# Altium project DoorControlSystem.PrjPcb
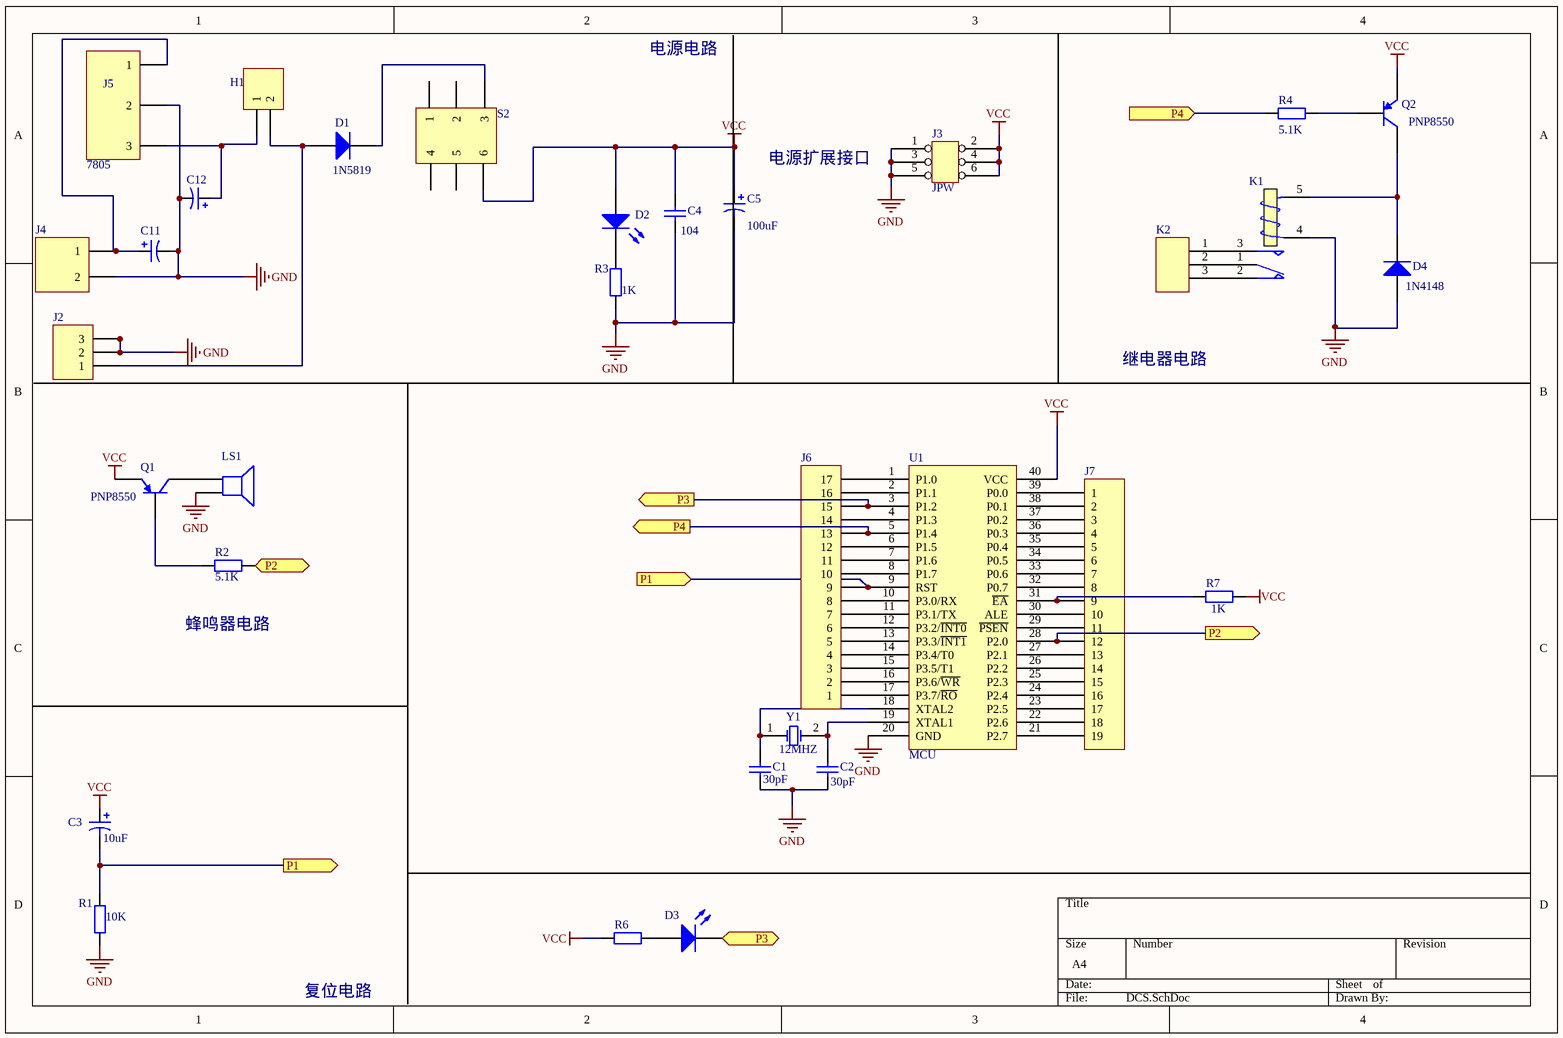
[diagram p0: DCS.SchDoc]
1 sheet, 32 parts. Net scope: flat (ports and power ports of the same name join across sheets).
Board file: PCB1.PcbDoc

## Sheet DCS.SchDoc
size A4

### Parts
C1  value 30pF  [CAP_104]  (hidden comment: Cap)
C2  value 30pF  [CAP_104]  (hidden comment: Cap)
C3  value 10uF  [CAP_10UF]  (hidden comment: Cap2)
C4  Cap  [CAP_104]  (value not drawn)
C5  value 100uF  [Cap_100uF]  (hidden comment: Cap2)
C11  Cap_100uF  [CAP_1000UF]  (value not drawn)
C12  Cap_100uF  [Cap_100uF]  (value not drawn)
D1  Diode 1N5408  [IN5819]  (value not drawn)
D2  LED0  [LED]  (value not drawn)
D3  LED0  [LED]  (value not drawn)
D4  Diode 1N4148  [DO-35]  (value not drawn)
H1  Header 2H  [Head2]  (value not drawn)
J2  Header 3  [POWER_DC5V]  (value not drawn)
J3  JPW  [JPW]
J4  Power_DC12V  [Power_DC12V]  (value not drawn)
J5  7805  [7805]
J6  Header 17  [HDR1X17]  (value not drawn)
J7  Header 19  [HDR1X19]  (value not drawn)
K1  Relay  [Relay]  (value not drawn)
K2  CRelay  [CRelay]  (value not drawn)
LS1  Speaker  [Speaker]  (value not drawn)
Q1  2N3906  [8550]  (value not drawn)
Q2  2N3906  [8550]  (value not drawn)
R1  value 10K  [AXIAL-0.4]  (hidden comment: Res2)
R2  value 5.1K  [AXIAL-0.4]  (hidden comment: Res2)
R3  value 1K  [AXIAL-0.4]  (hidden comment: Res2)
R4  value 5.1K  [AXIAL-0.4]  (hidden comment: Res2)
R6  Res2  [AXIAL-0.4]  (value not drawn)
R7  value 1K  [AXIAL-0.4]  (hidden comment: Res2)
S2  SW6  [SW6]  (value not drawn)
U1  MCU  [MCU]
Y1  XTAL  [crystals]  (value not drawn)

### Ports
P1 (in), P1 (out), P2 (in), P2 (out), P3, P3 (out), P4 (in), P4 (out)

### Nets
GND: C1.1 C2.1 C4.1 C5.2 C11.2 C12.2 D4.1(A) J2.2 J2.3 J3.1 J3.3 J3.5 J4.2 J5.2 K1.4(T) LS1.2 R1.1 R3.1 U1.20(GND)
VCC: C3.1 C4.2 C5.1 D2.1(A) J3.2 J3.4 J3.6 Q1.1(E) Q2.1(E) R6.1 R7.2 S2.6 U1.40(VCC)
NetC1_2: C1.2 U1.18(XTAL2) Y1.1(OSC1)
NetC2_2: C2.2 U1.19(XTAL1) Y1.2(OSC2)
NetC3_2: C3.2 J6.9 R1.2 U1.9(RST) ; port P1
NetC11_1: C11.1 J4.1 J5.1
NetC12_1: C12.1 H1.1 J5.3
NetD1_1: D1.1(A) H1.2 J2.1
NetD1_2: D1.2(K) S2.3
NetD2_2: D2.2(K) R3.2
NetD3_1: D3.1(A) R6.2
NetD3_2: D3.2(K) J6.15 U1.3(P1.2) ; port P3
NetD4_2: D4.2(K) K1.5(VSS) Q2.3(C)
NetJ6_1: J6.1 U1.17(P3.7/~{RO})
NetJ6_2: J6.2 U1.16(P3.6/~{WR})
NetJ6_3: J6.3 U1.15(P3.5/T1)
NetJ6_4: J6.4 U1.14(P3.4/T0)
NetJ6_5: J6.5 U1.13(P3.3/~{INT1})
NetJ6_6: J6.6 U1.12(P3.2/~{INT0})
NetJ6_7: J6.7 U1.11(P3.1/TX)
NetJ6_8: J6.8 U1.10(P3.0/RX)
NetJ6_10: J6.10 U1.8(P1.7)
NetJ6_11: J6.11 U1.7(P1.6)
NetJ6_12: J6.12 U1.6(P1.5)
NetJ6_13: J6.13 R4.2 U1.5(P1.4) ; port P4
NetJ6_14: J6.14 U1.4(P1.3)
NetJ6_16: J6.16 U1.2(P1.1)
NetJ6_17: J6.17 U1.1(P1.0)
NetJ7_1: J7.1 U1.39(P0.0)
NetJ7_2: J7.2 U1.38(P0.1)
NetJ7_3: J7.3 U1.37(P0.2)
NetJ7_4: J7.4 U1.36(P0.3)
NetJ7_5: J7.5 U1.35(P0.4)
NetJ7_6: J7.6 U1.34(P0.5)
NetJ7_7: J7.7 U1.33(P0.6)
NetJ7_8: J7.8 U1.32(P0.7)
NetJ7_9: J7.9 R7.1 U1.31(~{EA})
NetJ7_10: J7.10 U1.30(ALE)
NetJ7_11: J7.11 U1.29(~{PSEN})
NetJ7_12: J7.12 R2.1 U1.28(P2.0) ; port P2
NetJ7_13: J7.13 U1.27(P2.1)
NetJ7_14: J7.14 U1.26(P2.2)
NetJ7_15: J7.15 U1.25(P2.3)
NetJ7_16: J7.16 U1.24(P2.4)
NetJ7_17: J7.17 U1.23(P2.5)
NetJ7_18: J7.18 U1.22(P2.6)
NetJ7_19: J7.19 U1.21(P2.7)
NetK1_1: K1.1(COM) K2.2(COM)
NetK1_2: K1.2(NO) K2.3(NC)
NetK1_3: K1.3(NC) K2.1(NO)
NetLS1_1: LS1.1 Q1.3(C)
NetQ1_2: Q1.2(B) R2.2
NetQ2_2: Q2.2(B) R4.1

Not connected (* = marked no-connect by the designer): S2 1 2 4 5

### Notes on the sheet
- 电源电路
- (near D1) 1N5819
- (near C5) 电源扩展接口
- (near Q2) PNP8550
- (near C4) 104
- (near D4) 1N4148
- 继电器电路
- (near Q1) PNP8550
- (near R2) 蜂鸣器电路
- (near Y1) 12MHZ
- 复位电路
- Title
- Size:
- Date:
- A4
- Number:
- Time:
- Revision:
- Sheet
- of
- File:

### Library data of the parts
C1 C2 = Cap: Capacitor; Published: 8-Jun-2000; LatestRevisionDate: 17-Jul-2002; LatestRevisionNote: Re-released for DXP Platform.; PackageReference: RAD-0.3; Publisher: Altium Limited; PackageDescription: Radial Cap, Thru-Hole; 2 Leads; 0.3 in Pin Spacing
C3 C5 = Cap2: Polarized Capacitor (Axial); Published: 8-Jun-2000; LatestRevisionDate: 17-Jul-2002; LatestRevisionNote: Re-released for DXP Platform.; PackageReference: POLAR0.8; Publisher: Altium Limited; PackageDescription: Polarized Capacitor; 2 Leads
C4 = Cap: 104; Value: 100pF; Published: 8-Jun-2000; LatestRevisionDate: 17-Jul-2002; LatestRevisionNote: Re-released for DXP Platform.; PackageReference: RAD-0.3; Publisher: Altium Limited; PackageDescription: Radial Cap, Thru-Hole; 2 Leads; 0.3 in Pin Spacing
D1 = Diode 1N5408: 3 Amp Medium Power Silicon Rectifier Diode; Published: 8-Jun-2000; LatestRevisionDate: 17-Jul-2002; LatestRevisionNote: Re-released for DXP Platform.; DatasheetVersion: Aug-1984; PackageReference: DO-201AD; Publisher: Altium Limited; PackageDescription: Diode, Axial; Body 9.5 x 5.3 mm (LxDia. max), Lead Dia. 1.32 mm (max); ComponentLink1Description: Manufacturer Link; ComponentLink1URL: http://www.irf.com/
D2 D3 = LED0: Typical INFRARED GaAs LED; Published: 8-Jun-2000; LatestRevisionDate: 08-Jul-2005; LatestRevisionNote: Mech Layer 1 removed.; PackageReference: LED-0; Publisher: Altium Limited; PackageDescription: LED; 2 Leads
D4 = Diode 1N4148: High Conductance Fast Diode; Published: 8-Jun-2000; LatestRevisionDate: 17-Jul-2002; LatestRevisionNote: Re-released for DXP Platform.; DatasheetVersion: 1997; PackageReference: DO-35; Publisher: Altium Limited; PackageDescription: Diode, Axial; Body 3.8 x 1.9 mm (LxDia. max), Lead Dia. 0.53 mm (max); Code_JEDEC: DO-204-AH; ComponentLink1Description: Manufacturer Link; ComponentLink1URL: http://www.fairchildsemi.com/; ComponentLink2Description: Datasheet; ComponentLink2URL: http://www.fairchildsemi.com/ds/1N%2F1N4148.pdf
H1 = Header 2H: Header, 2-Pin, Right Angle; LatestRevisionDate: 17-Jul-2002; LatestRevisionNote: Re-released for DXP Platform.; Publisher: Altium Limited
J2 = Header 3: Header, 3-Pin; LatestRevisionDate: 17-Jul-2002; LatestRevisionNote: Re-released for DXP Platform.; Publisher: Altium Limited
J6 = Header 17: Header, 17-Pin; LatestRevisionDate: 17-Jul-2002; LatestRevisionNote: Re-released for DXP Platform.; Publisher: Altium Limited
J7 = Header 19: Header, 19-Pin; LatestRevisionDate: 17-Jul-2002; LatestRevisionNote: Re-released for DXP Platform.; Publisher: Altium Limited
K1 = Relay: HLS8L-DC5V-S-C; Published: 8-Jun-2000; LatestRevisionDate: 17-Jul-2002; LatestRevisionNote: Re-released for DXP Platform.; PackageReference: MODULE5B; Publisher: Altium Limited
LS1 = Speaker: Loudspeaker; Published: 24-Mar-1999; LatestRevisionDate: 17-Jul-2002; LatestRevisionNote: Re-released for DXP Platform.; PackageReference: PIN2; Publisher: Altium Limited
Q1 Q2 = 2N3906: PNP8550; Published: 8-Jun-2000; LatestRevisionDate: 15-Jan-2003; LatestRevisionNote: PCB Footprint 'BCY-W3/D4.7' replaced; DatasheetVersion: 1997; PackageVersion: Sep-1998; PackageReference: TO-92A; Publisher: Altium Limited; PackageDescription: TO, Flat Index; 3 In-Line, Axial Leads; Body Dia. 4.5mm; Leads 0.51 x 0.48 mm (max); ComponentLink1Description: Manufacturer Link; ComponentLink1URL: http://www.fairchildsemi.com/; ComponentLink2Description: Datasheet; ComponentLink2URL: http://www.fairchildsemi.com/ds/2N%2F2N3906.pdf
R1-R4 R7 = Res2: Resistor; Published: 8-Jun-2000; LatestRevisionDate: 17-Jul-2002; LatestRevisionNote: Re-released for DXP Platform.; PackageReference: AXIAL-0.4; Publisher: Altium Limited; PackageDescription: Axial Device, Thru-Hole; 2 Leads; 0.4 in Pin Spacing
R6 = Res2: Resistor; Value: 1K; Published: 8-Jun-2000; LatestRevisionDate: 17-Jul-2002; LatestRevisionNote: Re-released for DXP Platform.; PackageReference: AXIAL-0.4; Publisher: Altium Limited; PackageDescription: Axial Device, Thru-Hole; 2 Leads; 0.4 in Pin Spacing
U1 = MCU: STC89C52RC; TAuthor: fcf; Version: 1.0; TDate: 2014/9/4
Y1 = XTAL: Crystal Oscillator; Published: 8-Jun-2000; LatestRevisionDate: 17-Jul-2002; LatestRevisionNote: Re-released for DXP Platform.; PackageReference: R38; Publisher: Altium Limited; PackageDescription: Crystal, Thru-Hole; 2 Leads; Body 3.1 x 8.2 mm (Dia.xH)